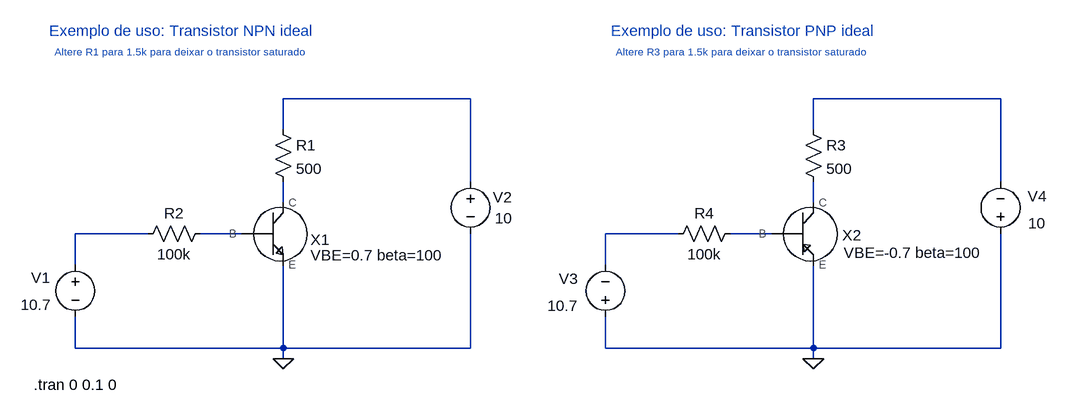
[diagram p0: schematic Exemplo.asc]
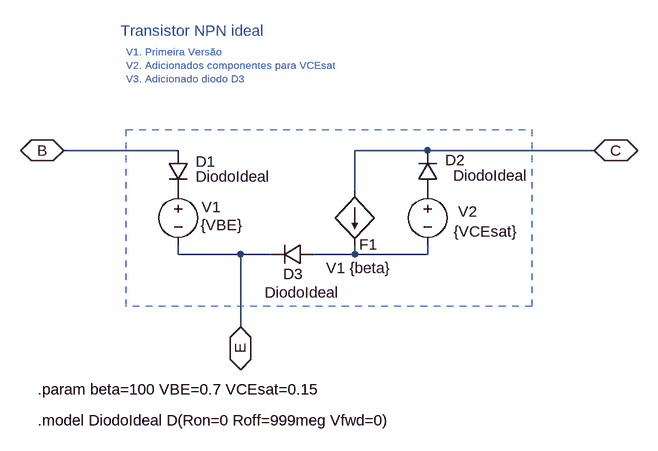
[diagram p1: sub-circuit bjt_npn_ideal.asc]
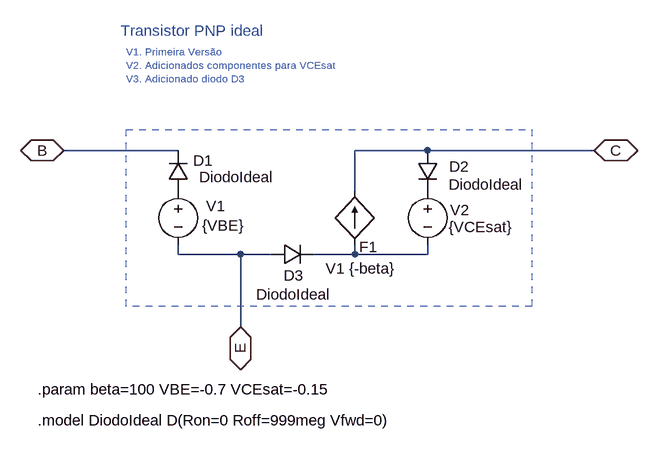
[diagram p2: sub-circuit bjt_pnp_ideal.asc]
Exemplo.asc, the LTspice schematic file:
Version 4
SHEET 1 1480 680
WIRE 496 -16 208 -16
WIRE 1312 -16 1024 -16
WIRE 208 32 208 -16
WIRE 1024 32 1024 -16
WIRE 496 112 496 -16
WIRE 1312 112 1312 -16
WIRE 208 144 208 112
WIRE 1024 144 1024 112
WIRE 0 192 -112 192
WIRE 144 192 80 192
WIRE 816 192 704 192
WIRE 960 192 896 192
WIRE -112 240 -112 192
WIRE 704 240 704 192
WIRE -112 368 -112 320
WIRE 208 368 208 240
WIRE 208 368 -112 368
WIRE 496 368 496 192
WIRE 496 368 208 368
WIRE 704 368 704 320
WIRE 1024 368 1024 240
WIRE 1024 368 704 368
WIRE 1312 368 1312 192
WIRE 1312 368 1024 368
WIRE 208 384 208 368
WIRE 1024 384 1024 368
FLAG 208 384 0
FLAG 1024 384 0
SYMBOL res 192 16 R0
SYMATTR InstName R1
SYMATTR Value 500
SYMBOL res -16 208 R270
WINDOW 0 32 56 VTop 2
WINDOW 3 0 56 VBottom 2
SYMATTR InstName R2
SYMATTR Value 100k
SYMBOL voltage -112 224 R0
WINDOW 123 0 0 Left 0
WINDOW 39 0 0 Left 0
WINDOW 0 -68 36 Left 2
WINDOW 3 -84 77 Left 2
SYMATTR InstName V1
SYMATTR Value 10.7
SYMBOL voltage 496 96 R0
WINDOW 123 0 0 Left 0
WINDOW 39 0 0 Left 0
WINDOW 0 35 40 Left 2
WINDOW 3 38 72 Left 2
SYMATTR InstName V2
SYMATTR Value 10
SYMBOL BJT_NPN_ideal 256 192 R0
WINDOW 0 9 25 Bottom 2
WINDOW 39 96 49 Bottom 2
SYMATTR InstName X1
SYMATTR SpiceLine VBE=0.7 beta=100
SYMBOL res 1008 16 R0
SYMATTR InstName R3
SYMATTR Value 500
SYMBOL res 800 208 R270
WINDOW 0 32 56 VTop 2
WINDOW 3 0 56 VBottom 2
SYMATTR InstName R4
SYMATTR Value 100k
SYMBOL voltage 704 336 R180
WINDOW 123 0 0 Left 0
WINDOW 39 0 0 Left 0
WINDOW 0 42 75 Left 2
WINDOW 3 42 33 Left 2
SYMATTR InstName V3
SYMATTR Value 10.7
SYMBOL voltage 1312 208 R180
WINDOW 123 0 0 Left 0
WINDOW 39 0 0 Left 0
WINDOW 0 -71 74 Left 2
WINDOW 3 -70 32 Left 2
SYMATTR InstName V4
SYMATTR Value 10
SYMBOL BJT_PNP_ideal 1072 192 R0
WINDOW 0 11 18 Bottom 2
WINDOW 39 105 45 Bottom 2
SYMATTR InstName X2
SYMATTR SpiceLine VBE=-0.7 beta=100
TEXT -176 424 Left 2 !.tran 0 0.1 0
TEXT -152 -120 Left 2 ;Exemplo de uso: Transistor NPN ideal
TEXT -144 -88 Left 1 ;Altere R1 para 1.5k para deixar o transistor saturado
TEXT 712 -120 Left 2 ;Exemplo de uso: Transistor PNP ideal
TEXT 720 -88 Left 1 ;Altere R3 para 1.5k para deixar o transistor saturado

bjt_npn_ideal.asc, the sub-circuit schematic file:
Version 4
SHEET 1 1136 728
WIRE 176 -448 0 -448
WIRE 560 -448 448 -448
WIRE 816 -448 560 -448
WIRE 448 -384 448 -448
WIRE 176 -288 176 -304
WIRE 272 -288 176 -288
WIRE 320 -288 272 -288
WIRE 448 -288 448 -304
WIRE 448 -288 384 -288
WIRE 560 -288 560 -304
WIRE 560 -288 448 -288
WIRE 272 -176 272 -288
FLAG 0 -448 B
IOPIN 0 -448 BiDir
FLAG 272 -176 E
IOPIN 272 -176 BiDir
FLAG 816 -448 C
IOPIN 816 -448 BiDir
SYMBOL voltage 176 -400 R0
WINDOW 123 0 0 Left 0
WINDOW 39 0 0 Left 0
WINDOW 3 35 67 Left 2
WINDOW 0 36 39 Left 2
SYMATTR Value {VBE}
SYMATTR InstName V1
SYMBOL f 448 -384 R0
WINDOW 3 -44 117 Left 2
WINDOW 0 7 81 Left 2
SYMATTR Value V1 {beta}
SYMATTR InstName F1
SYMBOL diode 160 -448 R0
WINDOW 0 43 17 Left 2
WINDOW 3 43 40 Left 2
SYMATTR InstName D1
SYMATTR Value DiodoIdeal
SYMBOL voltage 560 -400 R0
WINDOW 123 0 0 Left 0
WINDOW 39 0 0 Left 0
WINDOW 3 40 77 Left 2
WINDOW 0 47 46 Left 2
SYMATTR Value {VCEsat}
SYMATTR InstName V2
SYMBOL diode 576 -384 R180
WINDOW 0 -42 49 Left 2
WINDOW 3 -139 25 Left 2
SYMATTR InstName D2
SYMATTR Value DiodoIdeal
SYMBOL diode 384 -304 R90
WINDOW 0 62 31 VBottom 2
WINDOW 3 59 17 VTop 2
SYMATTR InstName D3
SYMATTR Value DiodoIdeal
TEXT -40 -80 Left 2 !.param beta=100 VBE=0.7 VCEsat=0.15
TEXT -40 -32 Left 2 !.model DiodoIdeal D(Ron=0 Roff=999meg Vfwd=0)
TEXT 88 -632 Left 2 ;Transistor NPN ideal
TEXT 96 -600 Left 1 ;V1. Primeira Versão\nV2. Adicionados componentes para VCEsat\nV3. Adicionado diodo D3
RECTANGLE Normal 720 -208 96 -480 2

bjt_pnp_ideal.asc, the sub-circuit schematic file:
Version 4
SHEET 1 1008 728
WIRE 176 -448 0 -448
WIRE 560 -448 448 -448
WIRE 816 -448 560 -448
WIRE 448 -384 448 -448
WIRE 176 -288 176 -304
WIRE 272 -288 176 -288
WIRE 320 -288 272 -288
WIRE 448 -288 448 -304
WIRE 448 -288 384 -288
WIRE 560 -288 560 -304
WIRE 560 -288 448 -288
WIRE 272 -176 272 -288
FLAG 0 -448 B
IOPIN 0 -448 BiDir
FLAG 272 -176 E
IOPIN 272 -176 BiDir
FLAG 816 -448 C
IOPIN 816 -448 BiDir
SYMBOL voltage 176 -400 R0
WINDOW 123 0 0 Left 0
WINDOW 39 0 0 Left 0
WINDOW 3 37 68 Left 2
WINDOW 0 43 38 Left 2
SYMATTR Value {VBE}
SYMATTR InstName V1
SYMBOL f 448 -304 R180
WINDOW 3 -63 -38 Left 2
WINDOW 0 -35 -5 Left 2
SYMATTR Value V1 {-beta}
SYMATTR InstName F1
SYMBOL diode 192 -384 R180
WINDOW 0 -38 48 Left 2
WINDOW 3 -132 23 Left 2
SYMATTR InstName D1
SYMATTR Value DiodoIdeal
SYMBOL voltage 560 -400 R0
WINDOW 123 0 0 Left 0
WINDOW 39 0 0 Left 0
WINDOW 3 32 70 Left 2
WINDOW 0 35 44 Left 2
SYMATTR Value {VCEsat}
SYMATTR InstName V2
SYMBOL diode 544 -448 R0
WINDOW 0 49 25 Left 2
WINDOW 3 48 53 Left 2
SYMATTR InstName D2
SYMATTR Value DiodoIdeal
SYMBOL diode 320 -272 R270
WINDOW 0 -32 34 VTop 2
WINDOW 3 -30 34 VBottom 2
SYMATTR InstName D3
SYMATTR Value DiodoIdeal
TEXT -40 -80 Left 2 !.param beta=100 VBE=-0.7 VCEsat=-0.15
TEXT -40 -32 Left 2 !.model DiodoIdeal D(Ron=0 Roff=999meg Vfwd=0)
TEXT 88 -632 Left 2 ;Transistor PNP ideal
TEXT 96 -600 Left 1 ;V1. Primeira Versão\nV2. Adicionados componentes para VCEsat\nV3. Adicionado diodo D3
RECTANGLE Normal 720 -208 96 -480 2

The netlist it stands for:
* Exemplo.asc
R1 N001 N003 500
R2 N005 N006 100k
V1 N005 0 10.7
V2 N001 0 10
XX1 N003 N006 0 bjt_npn_ideal params: VBE=0.7 beta=100
R3 N002 N004 500
R4 N007 N008 100k
V3 0 N007 10.7
V4 0 N002 10
XX2 N004 N008 0 bjt_pnp_ideal params: VBE=-0.7 beta=100

* block symbol definitions
.subckt bjt_npn_ideal C B E
V1 P001 E {VBE}
F1 C N001 V1 {beta}
D1 B P001 DiodoIdeal
V2 P002 N001 {VCEsat}
D2 P002 C DiodoIdeal
D3 N001 E DiodoIdeal
.param beta=100 VBE=0.7 VCEsat=0.15
.model DiodoIdeal D(Ron=0 Roff=999meg Vfwd=0)
* Transistor NPN ideal
* V1. Primeira Versão
* V2. Adicionados componentes para VCEsat
* V3. Adicionado diodo D3
.ends bjt_npn_ideal

.subckt bjt_pnp_ideal C B E
V1 P001 E {VBE}
F1 N001 C V1 {-beta}
D1 P001 B DiodoIdeal
V2 P002 N001 {VCEsat}
D2 C P002 DiodoIdeal
D3 E N001 DiodoIdeal
.param beta=100 VBE=-0.7 VCEsat=-0.15
.model DiodoIdeal D(Ron=0 Roff=999meg Vfwd=0)
* Transistor PNP ideal
* V1. Primeira Versão
* V2. Adicionados componentes para VCEsat
* V3. Adicionado diodo D3
.ends bjt_pnp_ideal

.model D D
.lib standard.dio
.tran 0 0.1 0
* Exemplo de uso: Transistor NPN ideal
* Altere R1 para 1.5k para deixar o transistor saturado
* Exemplo de uso: Transistor PNP ideal
* Altere R3 para 1.5k para deixar o transistor saturado
.backanno
.end